# EAGLE design SMT Nixie Board (HV5622) (EAGLE 9.6.2)
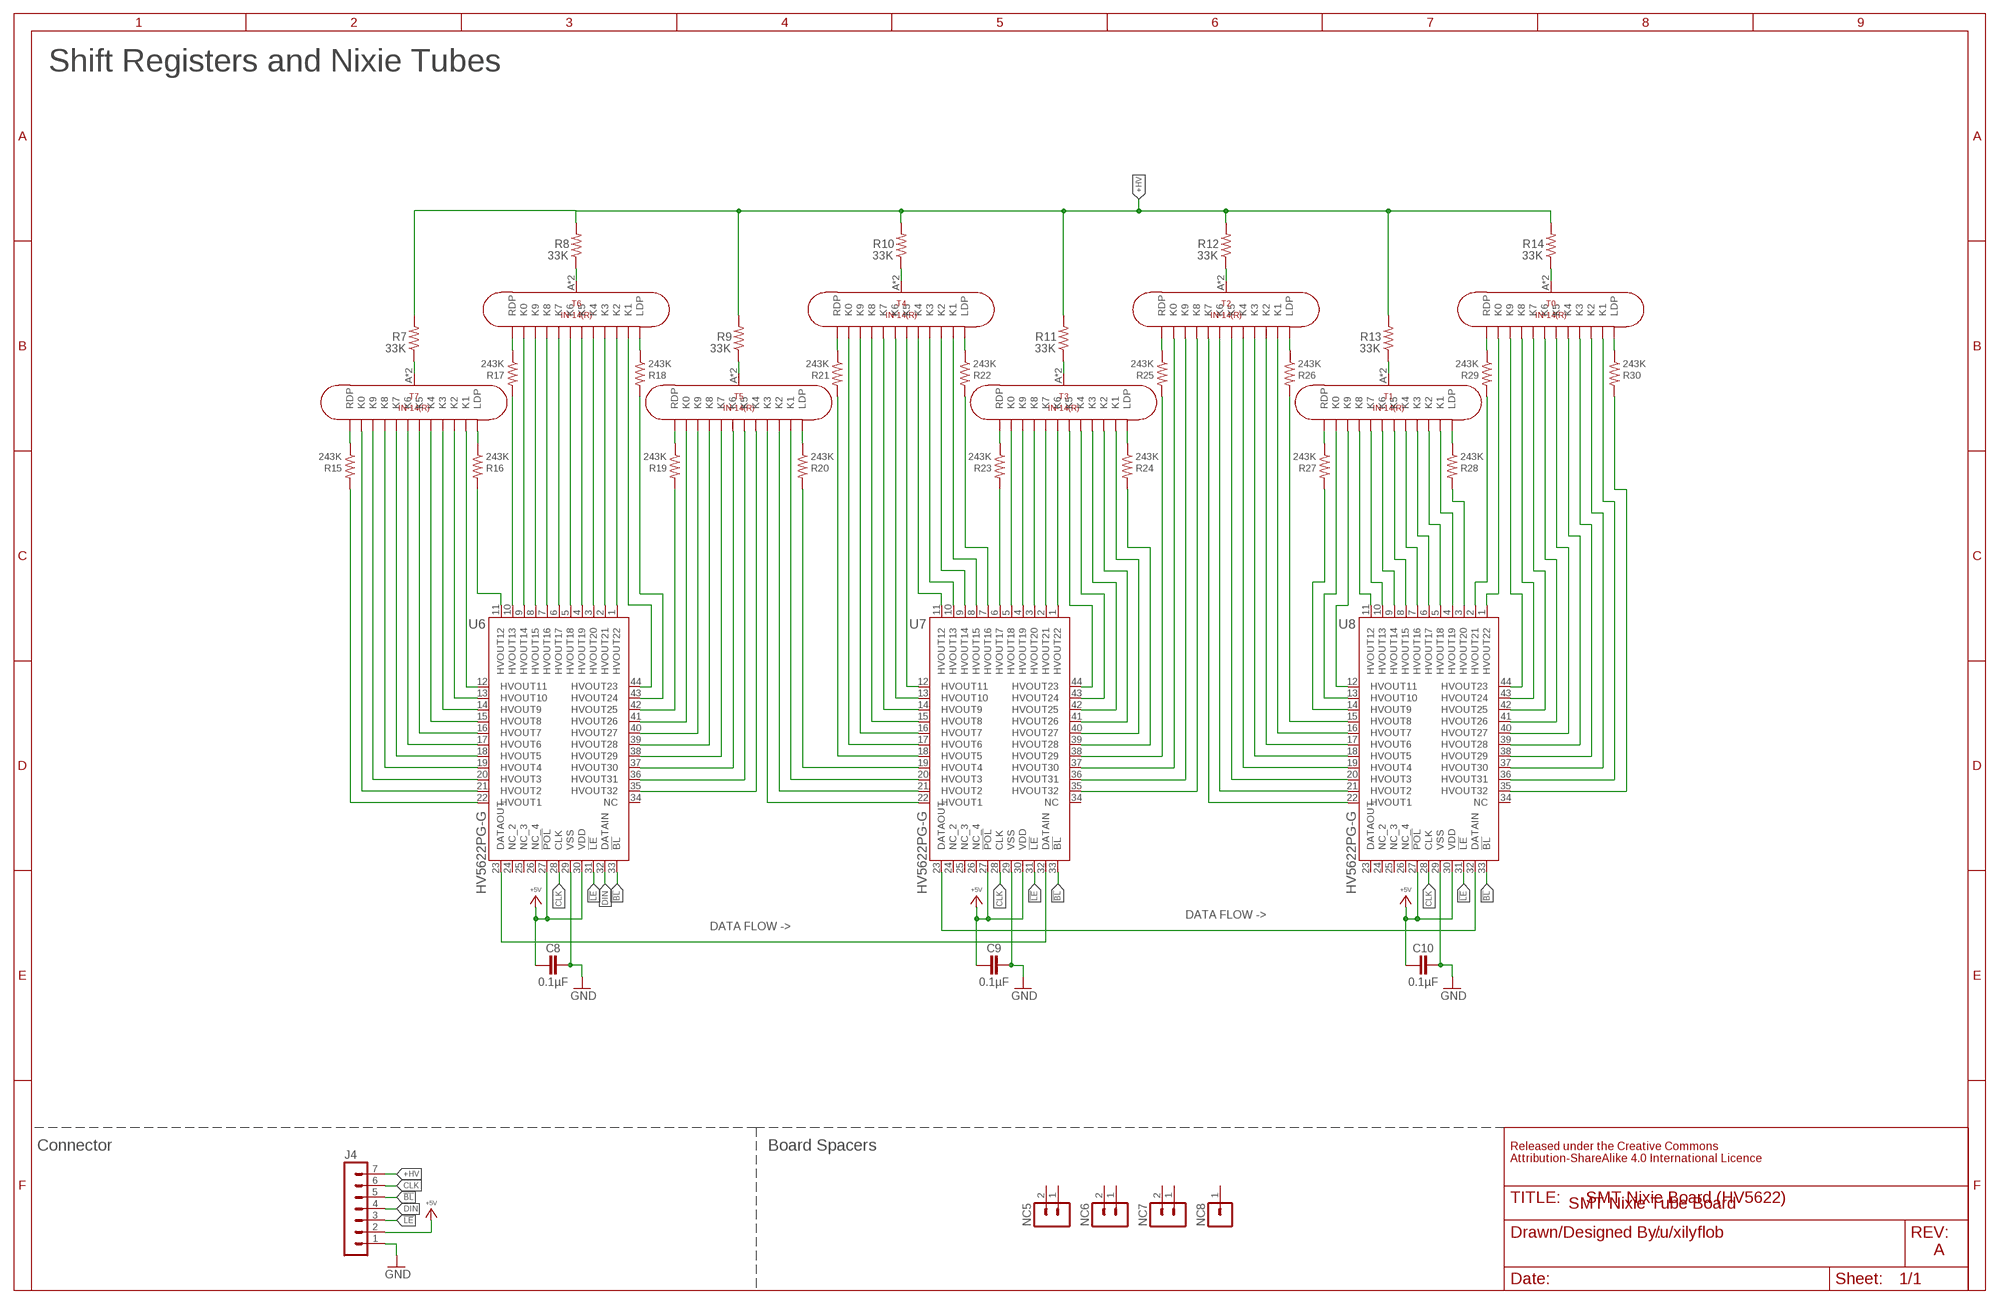
[diagram p0: schematic, sheet 1]

## Parts
C8  0.1µF  C-EU  [C0805]
C9  0.1µF  C-EU  [C0805]
C10  0.1µF  C-EU  [C0805]
J4  1  MA07  [MA07]
NC5  MA02  [MA02]
NC6  MA02  [MA02]
NC7  MA02  [MA02]
NC8  MA01  [MA01]
R7  33K  R-US_R2512  [R2512]
R8  33K  R-US_R2512  [R2512]
R9  33K  R-US_R2512  [R2512]
R10  33K  R-US_R2512  [R2512]
R11  33K  R-US_R2512  [R2512]
R12  33K  R-US_R2512  [R2512]
R13  33K  R-US_R2512  [R2512]
R14  33K  R-US_R2512  [R2512]
R15  243K  R-US_R2010  [R2010]
R16  243K  R-US_R2010  [R2010]
R17  243K  R-US_R2010  [R2010]
R18  243K  R-US_R2010  [R2010]
R19  243K  R-US_R2010  [R2010]
R20  243K  R-US_R2010  [R2010]
R21  243K  R-US_R2010  [R2010]
R22  243K  R-US_R2010  [R2010]
R23  243K  R-US_R2010  [R2010]
R24  243K  R-US_R2010  [R2010]
R25  243K  R-US_R2010  [R2010]
R26  243K  R-US_R2010  [R2010]
R27  243K  R-US_R2010  [R2010]
R28  243K  R-US_R2010  [R2010]
R29  243K  R-US_R2010  [R2010]
R30  243K  R-US_R2010  [R2010]
T0  IN-14(R)  [IN-14_REVERSE]
T1  IN-14(R)  [IN-14_REVERSE]
T2  IN-14(R)  [IN-14_REVERSE]
T3  IN-14(R)  [IN-14_REVERSE]
T4  IN-14(R)  [IN-14_REVERSE]
T5  IN-14(R)  [IN-14_REVERSE]
T6  IN-14(R)  [IN-14_REVERSE]
T7  IN-14(R)  [IN-14_REVERSE]
U6  HV5622PG-G  [QFP-44]
U7  HV5622PG-G  [QFP-44]
U8  HV5622PG-G  [QFP-44]

## Nets
!BL!: J4.5 U6.33(!BL) U7.33(!BL) U8.33(!BL)
!LE!: J4.3 U6.31(!LE) U7.31(!LE) U8.31(!LE)
+5V: C8.1 C9.1 C10.1 J4.2 U6.27(!POL) U6.30(VDD) U7.27(!POL) U7.30(VDD) U8.27(!POL) U8.30(VDD)
+HV: J4.7 R7.2 R8.2 R9.2 R10.2 R11.2 R12.2 R13.2 R14.2
CLK: J4.6 U6.28(CLK) U7.28(CLK) U8.28(CLK)
DIN: J4.4 U6.32(DATAIN)
GND: C8.2 C9.2 C10.2 J4.1 U6.29(VSS) U7.29(VSS) U8.29(VSS)
T0A: R7.1 T7.A T7.A_1(A)
T1A: R8.1 T6.A T6.A_1(A)
T2A: R9.1 T5.A T5.A_1(A)
T3A: R10.1 T4.A T4.A_1(A)
T4A: R11.1 T3.A T3.A_1(A)
T5A: R12.1 T2.A T2.A_1(A)
T6A: R13.1 T1.A T1.A_1(A)
T7A: R14.1 T0.A T0.A_1(A)
U5-T0K0: T7.K0 T7.K0_1(K0) U6.21(HVOUT2)
U5-T0K1: T7.K1 T7.K1_1(K1) U6.12(HVOUT11)
U5-T0K2: T7.K2 T7.K2_1(K2) U6.13(HVOUT10)
U5-T0K3: T7.K3 T7.K3_1(K3) U6.14(HVOUT9)
U5-T0K4: T7.K4 T7.K4_1(K4) U6.15(HVOUT8)
U5-T0K5: T7.K5 T7.K5_1(K5) U6.16(HVOUT7)
U5-T0K6: T7.K6 T7.K6_1(K6) U6.17(HVOUT6)
U5-T0K7: T7.K7 T7.K7_1(K7) U6.18(HVOUT5)
U5-T0K8: T7.K8 T7.K8_1(K8) U6.19(HVOUT4)
U5-T0K9: T7.K9 T7.K9_1(K9) U6.20(HVOUT3)
U5-T0LDP: R16.2 U6.11(HVOUT12)
U5-T0LDP1: R16.1 T7.LDP T7.LDP_1(LDP)
U5-T0RDP: R15.2 U6.22(HVOUT1)
U5-T0RDP1: R15.1 T7.RDP T7.RDP_1(RDP)
U5-T1K0: T6.K0 T6.K0_1(K0) U6.9(HVOUT14)
U5-T1K1: T6.K1 T6.K1_1(K1) U6.44(HVOUT23)
U5-T1K2: T6.K2 T6.K2_1(K2) U6.1(HVOUT22)
U5-T1K3: T6.K3 T6.K3_1(K3) U6.2(HVOUT21)
U5-T1K4: T6.K4 T6.K4_1(K4) U6.3(HVOUT20)
U5-T1K5: T6.K5 T6.K5_1(K5) U6.4(HVOUT19)
U5-T1K6: T6.K6 T6.K6_1(K6) U6.5(HVOUT18)
U5-T1K7: T6.K7 T6.K7_1(K7) U6.6(HVOUT17)
U5-T1K8: T6.K8 T6.K8_1(K8) U6.7(HVOUT16)
U5-T1K9: T6.K9 T6.K9_1(K9) U6.8(HVOUT15)
U5-T1LDP: R18.2 U6.43(HVOUT24)
U5-T1LDP1: R18.1 T6.LDP T6.LDP_1(LDP)
U5-T1RDP: R17.2 U6.10(HVOUT13)
U5-T1RDP1: R17.1 T6.RDP T6.RDP_1(RDP)
U5-T2K0: T5.K0 T5.K0_1(K0) U6.41(HVOUT26)
U5-T2K4: T5.K4 T5.K4_1(K4) U6.35(HVOUT32)
U5-T2K5: T5.K5 T5.K5_1(K5) U6.36(HVOUT31)
U5-T2K6: T5.K6 T5.K6_1(K6) U6.37(HVOUT30)
U5-T2K7: T5.K7 T5.K7_1(K7) U6.38(HVOUT29)
U5-T2K8: T5.K8 T5.K8_1(K8) U6.39(HVOUT28)
U5-T2K9: T5.K9 T5.K9_1(K9) U6.40(HVOUT27)
U5-T2RDP: R19.2 U6.42(HVOUT25)
U5-T2RDP1: R19.1 T5.RDP T5.RDP_1(RDP)
U5-U6: U6.23(DATAOUT) U7.32(DATAIN)
U6-T2K1: T5.K1 T5.K1_1(K1) U7.20(HVOUT3)
U6-T2K2: T5.K2 T5.K2_1(K2) U7.21(HVOUT2)
U6-T2K3: T5.K3 T5.K3_1(K3) U7.22(HVOUT1)
U6-T2LDP: R20.2 U7.19(HVOUT4)
U6-T2LDP1: R20.1 T5.LDP T5.LDP_1(LDP)
U6-T3K0: T4.K0 T4.K0_1(K0) U7.17(HVOUT6)
U6-T3K1: T4.K1 T4.K1_1(K1) U7.8(HVOUT15)
U6-T3K2: T4.K2 T4.K2_1(K2) U7.9(HVOUT14)
U6-T3K3: T4.K3 T4.K3_1(K3) U7.10(HVOUT13)
U6-T3K4: T4.K4 T4.K4_1(K4) U7.11(HVOUT12)
U6-T3K5: T4.K5 T4.K5_1(K5) U7.12(HVOUT11)
U6-T3K6: T4.K6 T4.K6_1(K6) U7.13(HVOUT10)
U6-T3K7: T4.K7 T4.K7_1(K7) U7.14(HVOUT9)
U6-T3K8: T4.K8 T4.K8_1(K8) U7.15(HVOUT8)
U6-T3K9: T4.K9 T4.K9_1(K9) U7.16(HVOUT7)
U6-T3LDP: R22.2 U7.7(HVOUT16)
U6-T3LDP1: R22.1 T4.LDP T4.LDP_1(LDP)
U6-T3RDP: R21.2 U7.18(HVOUT5)
U6-T3RDP1: R21.1 T4.RDP T4.RDP_1(RDP)
U6-T4K0: T3.K0 T3.K0_1(K0) U7.5(HVOUT18)
U6-T4K1: T3.K1 T3.K1_1(K1) U7.40(HVOUT27)
U6-T4K2: T3.K2 T3.K2_1(K2) U7.41(HVOUT26)
U6-T4K3: T3.K3 T3.K3_1(K3) U7.42(HVOUT25)
U6-T4K4: T3.K4 T3.K4_1(K4) U7.43(HVOUT24)
U6-T4K5: T3.K5 T3.K5_1(K5) U7.44(HVOUT23)
U6-T4K6: T3.K6 T3.K6_1(K6) U7.1(HVOUT22)
U6-T4K7: T3.K7 T3.K7_1(K7) U7.2(HVOUT21)
U6-T4K8: T3.K8 T3.K8_1(K8) U7.3(HVOUT20)
U6-T4K9: T3.K9 T3.K9_1(K9) U7.4(HVOUT19)
U6-T4LDP: R24.2 U7.39(HVOUT28)
U6-T4LDP1: R24.1 T3.LDP T3.LDP_1(LDP)
U6-T4RDP: R23.2 U7.6(HVOUT17)
U6-T4RDP1: R23.1 T3.RDP T3.RDP_1(RDP)
U6-T5K0: T2.K0 T2.K0_1(K0) U7.37(HVOUT30)
U6-T5K8: T2.K8 T2.K8_1(K8) U7.35(HVOUT32)
U6-T5K9: T2.K9 T2.K9_1(K9) U7.36(HVOUT31)
U6-T5RDP: R25.2 U7.38(HVOUT29)
U6-T5RDP1: R25.1 T2.RDP T2.RDP_1(RDP)
U6-U7: U7.23(DATAOUT) U8.32(DATAIN)
U7-T5K1: T2.K1 T2.K1_1(K1) U8.16(HVOUT7)
U7-T5K2: T2.K2 T2.K2_1(K2) U8.17(HVOUT6)
U7-T5K3: T2.K3 T2.K3_1(K3) U8.18(HVOUT5)
U7-T5K4: T2.K4 T2.K4_1(K4) U8.19(HVOUT4)
U7-T5K5: T2.K5 T2.K5_1(K5) U8.20(HVOUT3)
U7-T5K6: T2.K6 T2.K6_1(K6) U8.21(HVOUT2)
U7-T5K7: T2.K7 T2.K7_1(K7) U8.22(HVOUT1)
U7-T5LDP: R26.2 U8.15(HVOUT8)
U7-T5LDP1: R26.1 T2.LDP T2.LDP_1(LDP)
U7-T6K0: T1.K0 T1.K0_1(K0) U8.13(HVOUT10)
U7-T6K1: T1.K1 T1.K1_1(K1) U8.4(HVOUT19)
U7-T6K2: T1.K2 T1.K2_1(K2) U8.5(HVOUT18)
U7-T6K3: T1.K3 T1.K3_1(K3) U8.6(HVOUT17)
U7-T6K4: T1.K4 T1.K4_1(K4) U8.7(HVOUT16)
U7-T6K5: T1.K5 T1.K5_1(K5) U8.8(HVOUT15)
U7-T6K6: T1.K6 T1.K6_1(K6) U8.9(HVOUT14)
U7-T6K7: T1.K7 T1.K7_1(K7) U8.10(HVOUT13)
U7-T6K8: T1.K8 T1.K8_1(K8) U8.11(HVOUT12)
U7-T6K9: T1.K9 T1.K9_1(K9) U8.12(HVOUT11)
U7-T6LDP: R28.2 U8.3(HVOUT20)
U7-T6LDP1: R28.1 T1.LDP T1.LDP_1(LDP)
U7-T6RDP: R27.2 U8.14(HVOUT9)
U7-T6RDP1: R27.1 T1.RDP T1.RDP_1(RDP)
U7-T7K0: T0.K0 T0.K0_1(K0) U8.1(HVOUT22)
U7-T7K1: T0.K1 T0.K1_1(K1) U8.36(HVOUT31)
U7-T7K2: T0.K2 T0.K2_1(K2) U8.37(HVOUT30)
U7-T7K3: T0.K3 T0.K3_1(K3) U8.38(HVOUT29)
U7-T7K4: T0.K4 T0.K4_1(K4) U8.39(HVOUT28)
U7-T7K5: T0.K5 T0.K5_1(K5) U8.40(HVOUT27)
U7-T7K6: T0.K6 T0.K6_1(K6) U8.41(HVOUT26)
U7-T7K7: T0.K7 T0.K7_1(K7) U8.42(HVOUT25)
U7-T7K8: T0.K8 T0.K8_1(K8) U8.43(HVOUT24)
U7-T7K9: T0.K9 T0.K9_1(K9) U8.44(HVOUT23)
U7-T7LDP: R30.2 U8.35(HVOUT32)
U7-T7LDP1: R30.1 T0.LDP T0.LDP_1(LDP)
U7-T7RDP: R29.2 U8.2(HVOUT21)
U7-T7RDP1: R29.1 T0.RDP T0.RDP_1(RDP)
Unconnected: NC5.1 NC5.2 NC6.1 NC6.2 NC7.1 NC7.2 NC8.1 U6.24(NC_2) U6.25(NC_3) U6.26(NC_4) U6.34(NC) U7.24(NC_2) U7.25(NC_3) U7.26(NC_4) U7.34(NC) U8.23(DATAOUT) U8.24(NC_2) U8.25(NC_3) U8.26(NC_4) U8.34(NC)

## Notes on the sheet
- Shift Registers and Nixie Tubes
- DATA FLOW ->
- DATA FLOW ->
- Connector | Board Spacers
- Released under the Creative Commons
  Attribution-ShareAlike 4.0 International Licence
- SMT Nixie Tube Board
- /u/xilyflob
- A

## Library data of the parts
C8-C10 = My Imported Components:C-EU
J4 = My Imported Components:MA07: PIN HEADER; OC_FARNELL: unknown; OC_NEWARK: unknown
NC5-NC7 = My Imported Components:MA02: PIN HEADER
NC8 = My Imported Components:MA01: PIN HEADER
R7-R30 = rcl:R-US_: RESISTOR, American symbol; SPICEPREFIX: R
T0 T1-T7 = My Imported Components:IN-14
U6-U8 = My Imported Components:HV5622PG-G; BUILT_BY: EMA_Jessica; COPYRIGHT: Copyright (C) 2018 Accelerated Designs. All rights reserved; MANUFACTURER_PART_NUMBER: HV5622PG-G; SOURCELIBRARY: Microchip_2019-08-23_19; VENDOR: Microchip

## Board
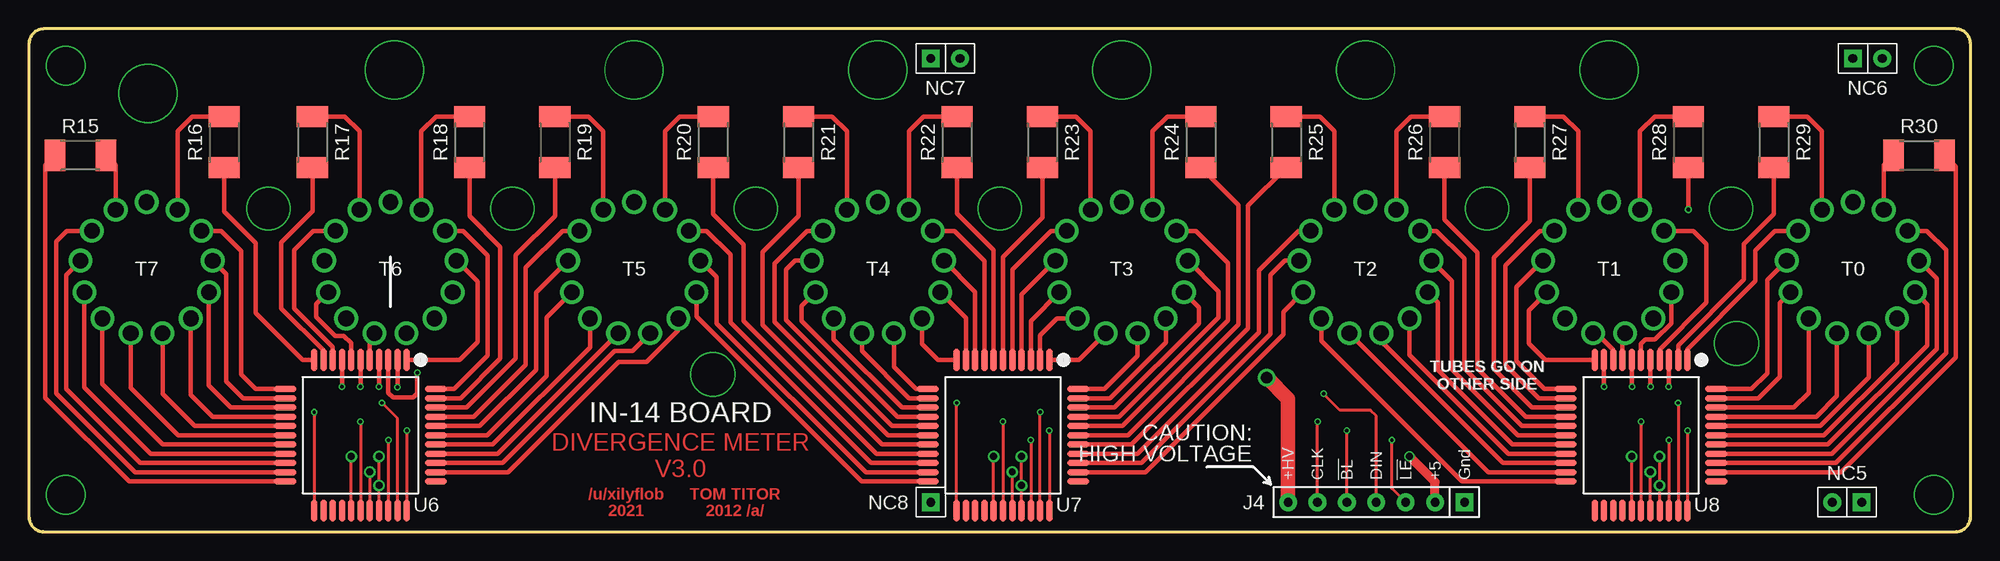
[diagram p1: board, top side]
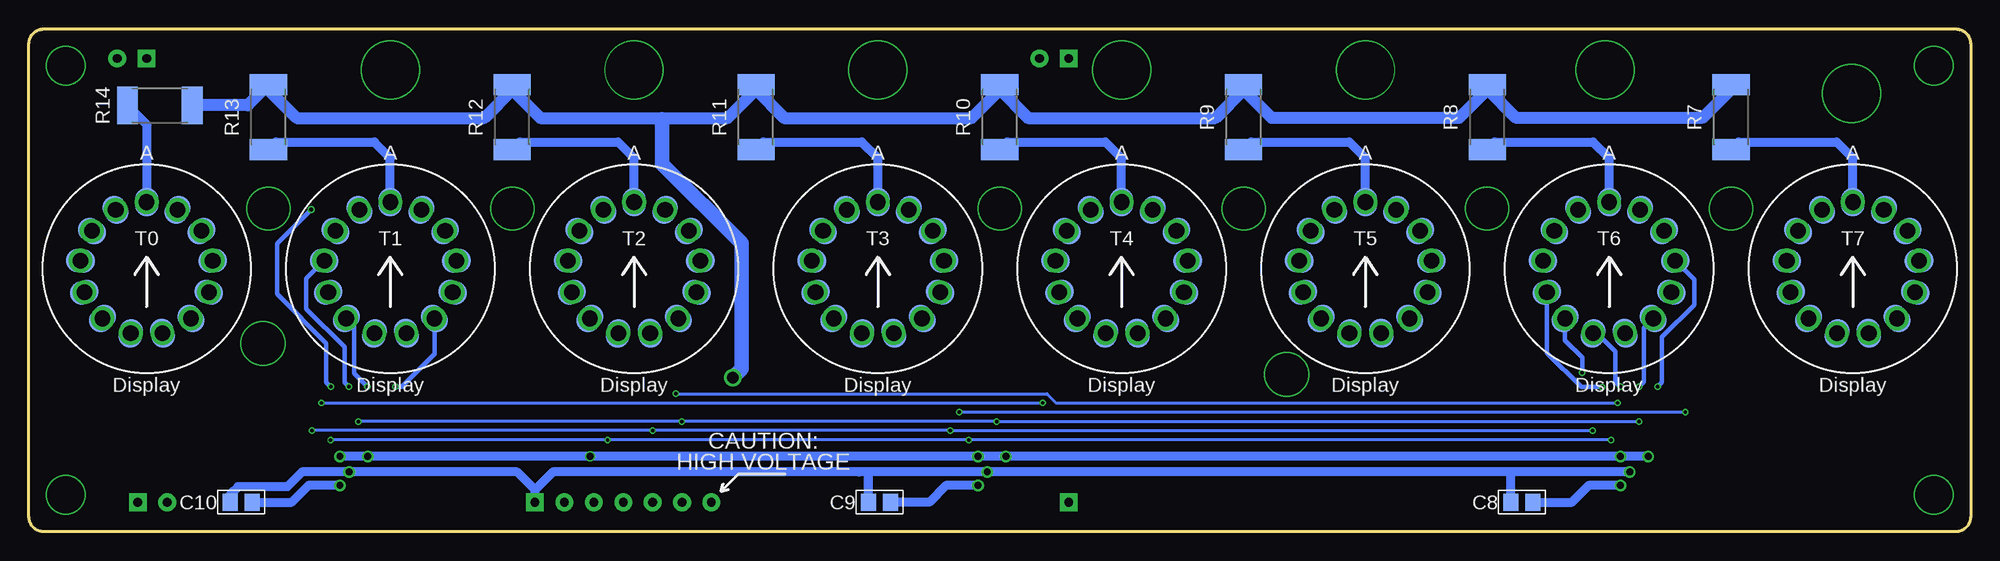
[diagram p2: board, bottom side, seen from below]

Size 167.64 x 43.43 mm. Coordinates in mm from the lower left corner, seen from the top.
Outline: 167.64,1.27 167.64,42.16 arc90 166.37,43.43 1.27,43.43 arc90 0,42.16 0,1.27 arc90 1.27,0 166.37,0 arc90 167.64,1.27
Copper layers (1*16): Top 0.035559375mm / dielectric 1.6mm / Bottom 0.035559375mm
Design rules "oshpark-2layer *": minimum track width 6mil, minimum drill 10mil, track to track 6mil, track to pad 6mil, pad to pad 6mil, via to via 6mil, smd to smd 6mil, copper to edge 15mil, drill to drill 6mil, minimum pad ring 5mil, minimum via ring 5mil, stop-mask expansion 2.5mil, vias tented up to drill 30mil, thermal gap 10mil

### Footprints (pad centres in the part's own frame; a part is rotated, then mirrored left to right if it is on the bottom)
C0805 = smd 1.3 x 1.5: 1 -0.95,0; 2 0.95,0
MA07 = drill 0.75 pad 1.524 square: 1 -7.62,0 | drill 0.75 pad 1.524: 2 -5.08,0; 3 -2.54,0; 4 0,0; 5 2.54,0; 6 5.08,0; 7 7.62,0
MA02 = drill 0.75 pad 1.524 square: 1 -1.27,0 | drill 0.75 pad 1.524: 2 1.27,0
MA01 = drill 0.75 pad 1.524 square: 1 0,0
R2512 = smd 1.8 x 3.2: 1 -2.8,0; 2 2.8,0
R2010 = smd 1.8 x 2.7: 1 -2.2,0; 2 2.2,0
IN-14_REVERSE = drill 1.35 pad 2.05: A 0,5.75; K0 4.732,3.266; K1 -4.732,3.266; K2 -5.708,0.693; K3 -5.376,-2.039; K4 -3.813,-4.304; K5 -1.376,-5.583; K6 1.376,-5.583; K7 3.813,-4.304; K8 5.376,-2.039; K9 5.708,0.693; LDP -2.672,5.091; RDP 2.672,5.091 | smd 2.05 x 2.5: A_1 0,5.75 | smd 2.05 x 2.5 rotated 124.6: K0_1 4.732,3.266 | smd 2.05 x 2.5 rotated 235.4: K1_1 -4.732,3.266 | smd 2.05 x 2.5 rotated 263.1: K2_1 -5.708,0.693 | smd 2.05 x 2.5 rotated 290.7: K3_1 -5.376,-2.039 | smd 2.05 x 2.5 rotated 318.4: K4_1 -3.813,-4.304 | smd 2.05 x 2.5 rotated 346.1: K5_1 -1.376,-5.583 | smd 2.05 x 2.5 rotated 13.9: K6_1 1.376,-5.583 | smd 2.05 x 2.5 rotated 41.6: K7_1 3.813,-4.304 | smd 2.05 x 2.5 rotated 69.3: K8_1 5.376,-2.039 | smd 2.05 x 2.5 rotated 96.9: K9_1 5.708,0.693 | smd 2.05 x 2.5 rotated 207.7: LDP_1 -2.672,5.091 | smd 2.05 x 2.5 rotated 152.3: RDP_1 2.672,5.091
QFP-44 = smd 1.9 x 0.55: 1 -6.5,4; 2 -6.5,3.2; 3 -6.5,2.4; 4 -6.5,1.6; 5 -6.5,0.8; 6 -6.5,0; 7 -6.5,-0.8; 8 -6.5,-1.6; 9 -6.5,-2.4; 10 -6.5,-3.2; 11 -6.5,-4; 23 6.5,-4; 24 6.5,-3.2; 25 6.5,-2.4; 26 6.5,-1.6; 27 6.5,-0.8; 28 6.5,0; 29 6.5,0.8; 30 6.5,1.6; 31 6.5,2.4; 32 6.5,3.2; 33 6.5,4 | smd 0.55 x 1.9: 12 -4,-6.5; 13 -3.2,-6.5; 14 -2.4,-6.5; 15 -1.6,-6.5; 16 -0.8,-6.5; 17 0,-6.5; 18 0.8,-6.5; 19 1.6,-6.5; 20 2.4,-6.5; 21 3.2,-6.5; 22 4,-6.5; 34 4,6.5; 35 3.2,6.5; 36 2.4,6.5; 37 1.6,6.5; 38 0.8,6.5; 39 0,6.5; 40 -0.8,6.5; 41 -1.6,6.5; 42 -2.4,6.5; 43 -3.2,6.5; 44 -4,6.5

### Placement (x,y rotation side)
C8  38.73,2.54 180 bottom
C9  94.21,2.54 180 bottom
C10  149.3,2.54 180 bottom
J4  116.33,2.54 180 top
NC5  156.97,2.54 180 top
NC6  158.75,40.89 0 top
NC7  79.12,40.89 0 top
NC8  77.85,2.54 180 top
R7  20.68,35.81 90 bottom
R8  41.73,35.81 90 bottom
R9  62.76,35.81 90 bottom
R10  83.82,35.81 90 bottom
R11  104.88,35.81 90 bottom
R12  125.91,35.81 90 bottom
R13  146.96,35.81 90 bottom
R14  156.34,36.83 0 bottom
R15  4.45,32.51 180 top
R16  16.87,33.66 270 top
R17  24.49,33.66 270 top
R18  38.05,33.66 270 top
R19  45.42,33.66 270 top
R20  59.08,33.66 270 top
R21  66.45,33.66 270 top
R22  80.14,33.66 270 top
R23  87.5,33.66 270 top
R24  101.19,33.66 270 top
R25  108.56,33.66 270 top
R26  122.22,33.66 270 top
R27  129.59,33.66 270 top
R28  143.28,33.66 270 top
R29  150.65,33.66 270 top
R30  163.19,32.51 0 top
T0  157.48,22.73 0 bottom
T1  136.43,22.73 0 bottom
T2  115.39,22.73 0 bottom
T3  94.34,22.73 0 bottom
T4  73.3,22.73 0 bottom
T5  52.25,22.73 0 bottom
T6  31.21,22.73 0 bottom
T7  10.16,22.73 0 bottom
U6  28.63,8.33 270 top
U7  84.1,8.33 270 top
U8  139.19,8.33 270 top

### Tracks (layer width: path | path; a pad name or v marks a point on that pad's centre or on a via)
!BL!  (via drill 0.3 pad 0.55)
  Top 0.254: J4.5 v113.79,8.74 | v88.1,8.74 U7.33 | v32.63,8.74 U6.33 | v143.19,8.74 U8.33
  Bottom 0.254: v32.63,8.74 v88.1,8.74 v113.79,8.74 v143.19,8.74
!LE!  (via drill 0.3 pad 0.55)
  Top 0.254: J4.3 117.68,3.73 v117.68,7.92 | v86.5,7.92 U7.31 | v31.03,7.92 U6.31 | v141.59,7.92 U8.31
  Bottom 0.254: v31.03,7.92 v86.5,7.92 v117.68,7.92 v141.59,7.92
+5V  (via drill 0.6 pad 0.8, 0.6 pad 1)
  Top 0.254: U6.27 v27.83,6.5 | U6.30 v30.23,3.99 v30.23,6.5 | U7.30 v85.7,3.99 v85.7,6.5 | U7.27 v83.3,6.5 | U8.30 v140.79,3.99 v140.79,6.5 | U8.27 v138.39,6.5
  Top 0.762: J4.2 121.41,4.29 v119.2,6.5
  Bottom 0.762: v27.83,6.5 v30.23,6.5 v83.3,6.5 v85.7,6.5 v119.2,6.5 v138.39,6.5 v140.79,6.5 | v140.79,3.99 143.51,3.99 144.96,2.54 C10.1 | v85.7,3.99 88.44,3.99 89.89,2.54 C9.1 | v30.23,3.99 32.97,3.99 34.42,2.54 C8.1
+HV  (via drill 1 pad 1.5)
  Top 1.27: v106.88,13.31 108.71,11.48 J4.7
  Bottom 0.762: 112.98,35.23 112.98,35.74
  Bottom 1.016: 62.77,38.18 65.21,35.74 81.38,35.74 83.82,38.18 | 83.82,38.18 86.26,35.74 102.43,35.74 104.88,38.19 R11.2 104.88,38.16 107.3,35.74 112.98,35.74 123.47,35.74 125.91,38.17 R12.2 125.91,38.18 128.35,35.74 144.52,35.74 146.96,38.18 R13.2 148.75,36.83 R14.2 | R8.2 41.73,38.23 | 41.73,38.23 41.73,38.18 44.17,35.74 60.33,35.74 62.77,38.18 | 41.73,38.23 39.29,35.79 23.11,35.79 20.68,38.23 R7.2 | R10.2 83.82,38.18 | R9.2 62.77,38.18
  Bottom 1.27: v106.88,13.31 106.12,14.07 106.12,24.92 112.98,31.77 112.98,35.23
CLK  (via drill 0.3 pad 0.55)
  Top 0.254: J4.6 v111.25,9.53 | v84.1,9.53 U7.28 | v28.63,9.53 U6.28 | v139.19,9.53 U8.28
  Bottom 0.254: v28.63,9.53 v84.1,9.53 v111.25,9.53 v139.19,9.53
DIN  (via drill 0.3 pad 0.55)
  Top 0.254: v30.48,11.12 31.83,9.78 U6.32 | v111.78,11.91 113.21,10.49 115.82,10.49 116.33,9.98 J4.4
  Bottom 0.254: v111.78,11.91 79.73,11.91 78.94,11.12 v30.48,11.12
GND  (via drill 0.6 pad 1)
  Top 0.254: v29.43,5.16 U6.29 | U7.29 v84.9,5.16 | U8.29 v139.99,5.16
  Bottom 0.762: v29.43,5.16 39.7,5.16 | 39.7,5.16 v84.9,5.16 95.15,5.16 | 95.15,5.16 96.01,5.16 122.4,5.16 123.95,3.61 | J4.1 123.95,3.61 | 123.95,3.61 125.5,5.16 v139.99,5.16 144.07,5.16 145.34,3.89 149.58,3.89 150.25,3.22 C10.2 | C8.2 39.69,5.14 39.7,5.16 | C9.2 95.16,5.15 95.15,5.16
N$1  (via drill 3.66)
  other vias: 59.05,13.59
N$2  (via drill 4.88)
  other vias: 52.25,39.88
N$3  (via drill 3.58)
  other vias: 83.82,27.91
N$4  (via drill 3.58)
  other vias: 62.76,27.91
N$5  (via drill 3.58)
  other vias: 20.68,27.91
N$6  (via drill 3.66)
  other vias: 147.45,16.26
N$7  (via drill 4.88)
  other vias: 115.39,39.88
N$8  (via drill 3.58)
  other vias: 41.73,27.91
N$9  (via drill 3.58)
  other vias: 146.96,27.91
N$10  (via drill 3.17)
  other vias: 3.17,3.17
N$11  (via drill 3.17)
  other vias: 164.47,3.17
N$12  (via drill 3.17)
  other vias: 3.17,40.26
N$13  (via drill 3.17)
  other vias: 164.47,40.26
N$14  (via drill 4.88)
  other vias: 73.29,39.88
N$15  (via drill 4.88)
  other vias: 94.35,39.88
N$16  (via drill 4.88)
  other vias: 136.44,39.88
N$17  (via drill 4.88)
  other vias: 31.55,39.88
N$18  (via drill 3.58)
  other vias: 125.91,27.91
N$19  (via drill 4.88)
  other vias: 10.29,37.85
T0A
  Bottom 0.762: T7.A_1 10.16,32.26 11.56,33.66 20.04,33.66 R7.1
T1A
  Bottom 0.762: T6.A_1 31.21,32.26 32.6,33.66 41.09,33.66 R8.1
T2A
  Bottom 0.762: T5.A_1 52.25,32.26 53.65,33.66 62.12,33.66 R9.1
T3A
  Bottom 0.762: T4.A_1 73.3,32.26 74.69,33.66 83.18,33.66 R10.1
T4A
  Bottom 0.762: T3.A_1 94.34,32.26 95.74,33.66 104.24,33.66 R11.1
T5A
  Bottom 0.762: T2.A_1 115.39,32.26 116.79,33.66 125.27,33.66 R12.1
T6A
  Bottom 0.762: T1.A_1 136.43,32.26 137.83,33.66 146.32,33.66 R13.1
T7A
  Bottom 0.762: R14.1 157.48,35.17 T0.A_1
U5-T0K0
  Top 0.381: U6.21 9.17,5.13 2.34,11.96 2.34,25.08 3.25,25.99 T7.K0_1
U5-T0K1
  Top 0.381: U6.12 19.58,12.33 18.31,13.6 18.31,24.26 16.58,25.99 T7.K1_1
U5-T0K2
  Top 0.381: U6.13 18.48,11.53 17.04,12.97 17.04,22.24 T7.K2_1 | T7.K2_1
U5-T0K3
  Top 0.381: U6.14 17.43,10.73 15.54,12.62 T7.K3_1
U5-T0K4
  Top 0.381: U6.15 15.88,9.93 13.97,11.84 T7.K4_1
U5-T0K5
  Top 0.381: U6.16 14.29,9.13 11.54,11.89 T7.K5_1
U5-T0K6
  Top 0.381: U6.17 12.87,8.33 8.78,12.42 T7.K6_1
U5-T0K7
  Top 0.381: U6.18 11.57,7.53 6.35,12.75 T7.K7_1
U5-T0K8
  Top 0.381: U6.19 10.5,6.73 4.78,12.45 T7.K8_1
U5-T0K9
  Top 0.381: U6.20 9.61,5.93 3.23,12.32 3.23,22.19 T7.K9_1
U5-T0LDP
  Top 0.381: U6.11 23.65,14.83 19.58,18.9 19.58,24.94 16.87,27.66 R16.2
U5-T0LDP1
  Top 0.381: T7.LDP_1 12.83,34.59 14.1,35.85 R16.1
U5-T0RDP
  Top 0.381: U6.22 8.65,4.33 1.42,11.56 1.42,31.69 R15.2
U5-T0RDP1
  Top 0.381: T7.RDP_1 7.49,31.67 R15.1
U5-T1K0
  Top 0.381: U6.9 26.23,15.95 22.9,19.28 22.9,24.33 24.56,25.99 T6.K0_1
U5-T1K1
  Top 0.381: U6.44 36.73,12.33 39.61,15.21 39.61,23.85 37.47,25.99 T6.K1_1
U5-T1K2
  Top 0.381: U6.1 37.17,14.83 38.72,16.38 38.72,21.61 T6.K2_1 | T6.K2_1
U5-T1K3  (via drill 0.3 pad 0.55)
  Top 0.381: U6.2 v31.83,12.5
  Bottom 0.381: v31.83,12.5 33.62,12.5 36.58,15.46 | T6.K3_1 36.58,15.46 | 36.58,15.46
U5-T1K4  (via drill 0.3 pad 0.55)
  Top 0.381: U6.3 31.03,12 31.45,11.58 33.17,11.58 33.53,11.94 v33.53,13.74
  Bottom 0.381: v33.53,13.74 33.53,15.04 35.02,16.53 T6.K4_1
U5-T1K5  (via drill 0.3 pad 0.55)
  Top 0.381: U6.4 v30.23,12.52
  Bottom 0.381: v30.23,12.52 30.65,12.94 30.65,15.56 32.23,17.14 T6.K5_1
U5-T1K6
  Top 0.381: U6.5 29.43,16.74 T6.K6_1
U5-T1K7  (via drill 0.3 pad 0.55)
  Top 0.381: U6.6 v28.63,12.52
  Bottom 0.381: v28.63,12.52 28.21,12.94 28.21,17.61 T6.K7_1 | T6.K7_1
U5-T1K8
  Top 0.381: U6.7 27.83,16.28 27.19,16.92 26.43,16.92 24.8,18.54 24.8,19.66 T6.K8_1
U5-T1K9  (via drill 0.3 pad 0.55)
  Top 0.381: U6.8 v27.03,12.52
  Bottom 0.381: v27.03,12.52 26.63,12.91 26.63,16.82 23.86,19.58 23.86,21.79 T6.K9_1
U5-T1LDP
  Top 0.381: U6.43 37.26,11.53 40.69,14.96 40.69,24.61 38.05,27.25 R18.2
U5-T1LDP1
  Top 0.381: R18.1 35.15,35.85 33.88,34.59 T6.LDP_1
U5-T1RDP
  Top 0.381: U6.10 25.43,15.65 21.79,19.28 21.79,24.99 24.49,27.69 R17.2
U5-T1RDP1
  Top 0.381: T6.RDP_1 28.53,34.59 27.26,35.85 R17.1
U5-T2K0
  Top 0.381: U6.41 38.38,9.93 42.88,14.43 42.88,22.81 46.06,25.99 T5.K0_1
U5-T2K4
  Top 0.381: U6.35 41.38,5.13 50.91,14.66 53.32,14.66 56.06,17.4 T5.K4_1
U5-T2K5
  Top 0.381: U6.36 40.88,5.93 50.58,15.62 52.11,15.62 T5.K5_1 | T5.K5_1
U5-T2K6
  Top 0.381: U6.37 40.46,6.73 T5.K6_1
U5-T2K7
  Top 0.381: U6.38 40.05,7.53 48.44,15.92 T5.K7_1
U5-T2K8
  Top 0.381: U6.39 39.58,8.33 44.68,13.44 44.68,18.49 T5.K8_1
U5-T2K9
  Top 0.381: U6.40 38.93,9.13 43.77,13.97 43.77,20.64 T5.K9_1
U5-T2RDP
  Top 0.381: U6.42 37.78,10.73 42.04,14.99 42.04,23.88 45.41,27.26 R19.2
U5-T2RDP1
  Top 0.381: R19.1 48.31,35.85 49.58,34.59 T5.RDP_1
U5-U6  (via drill 0.3 pad 0.55)
  Top 0.254: v24.63,10.34 U6.23 | U7.32 v87.3,10.34
  Bottom 0.254: v87.3,10.34 v24.63,10.34
U6-T2K1
  Top 0.381: U7.20 72.71,5.93 60.58,18.06 60.58,23.93 58.52,25.99 T5.K1_1
U6-T2K2
  Top 0.381: U7.21 72.27,5.13 59.39,18.01 59.39,21.99 T5.K2_1
U6-T2K3
  Top 0.381: U7.22 71.87,4.33 57.63,18.58 T5.K3_1
U6-T2LDP
  Top 0.381: U7.19 73.2,6.73 61.72,18.21 61.72,24.82 59.08,27.46 R20.2
U6-T2LDP1
  Top 0.381: R20.1 56.19,35.85 54.92,34.59 T5.LDP_1
U6-T3K0
  Top 0.381: U7.17 74.16,8.33 64.36,18.14 64.36,23.16 67.18,25.99 T4.K0_1
U6-T3K1
  Top 0.381: U7.8 82.5,23.39 79.89,25.99 T4.K1_1
U6-T3K2
  Top 0.381: U7.9 81.7,20.72 T4.K2_1
U6-T3K3
  Top 0.381: U7.10 80.9,18.46 T4.K3_1
U6-T3K4
  Top 0.381: U7.11 78.51,14.83 77.11,16.23 T4.K4_1
U6-T3K5
  Top 0.381: U7.12 76.59,12.33 74.67,14.24 T4.K5_1
U6-T3K6
  Top 0.381: U7.13 75.99,11.53 71.92,15.6 T4.K6_1
U6-T3K7
  Top 0.381: U7.14 75.37,10.73 69.48,16.61 T4.K7_1
U6-T3K8
  Top 0.381: U7.15 75,9.93 66.72,18.21 66.72,19.48 T4.K8_1
U6-T3K9
  Top 0.381: U7.16 74.53,9.13 65.37,18.29 65.37,22.66 66.13,23.42 T4.K9_1
U6-T3LDP
  Top 0.381: U7.7 83.3,24.33 80.14,27.5 R22.2
U6-T3LDP1
  Top 0.381: R22.1 77.24,35.85 75.97,34.59 T4.LDP_1
U6-T3RDP
  Top 0.381: U7.18 73.65,7.53 63.32,17.86 63.32,24.14 66.45,27.27 R21.2
U6-T3RDP1
  Top 0.381: R21.1 69.36,35.85 70.62,34.59 T4.RDP_1
U6-T4K0
  Top 0.381: U7.5 84.9,22.66 88.23,25.99 T3.K0_1
U6-T4K1
  Top 0.381: U7.40 94.42,9.13 103.53,18.24 103.53,23.22 100.75,25.99 T3.K1_1
U6-T4K2
  Top 0.381: U7.41 94.11,9.93 102.7,18.52 102.7,20.77 T3.K2_1
U6-T4K3
  Top 0.381: U7.42 93.75,10.73 101.02,18.01 101.02,19.38 T3.K3_1
U6-T4K4
  Top 0.381: U7.43 93.35,11.53 98.16,16.34 T3.K4_1
U6-T4K5
  Top 0.381: U7.44 92.86,12.33 95.72,15.19 T3.K5_1
U6-T4K6
  Top 0.381: U7.1 90.66,14.83 T3.K6_1
U6-T4K7
  Top 0.381: U7.2 87.3,16.96 88.76,18.42 T3.K7_1
U6-T4K8
  Top 0.381: U7.3 86.5,18.22 T3.K8_1
U6-T4K9
  Top 0.381: U7.4 85.7,20.48 T3.K9_1
U6-T4LDP
  Top 0.381: U7.39 94.87,8.33 104.42,17.88 104.42,28.23 R24.2
U6-T4LDP1
  Top 0.381: R24.1 98.28,35.85 97.02,34.59 T3.LDP_1
U6-T4RDP
  Top 0.381: U7.6 84.1,23.75 87.5,27.15 R23.2
U6-T4RDP1
  Top 0.381: R23.1 90.4,35.85 91.67,34.59 T3.RDP_1
U6-T5K0
  Top 0.381: U7.37 95.7,6.73 106.19,17.22 106.19,22.58 109.61,25.99 T2.K0_1
U6-T5K8
  Top 0.381: U7.35 96.42,5.13 108.33,17.04 108.33,19 T2.K8_1
U6-T5K9
  Top 0.381: U7.36 96.07,5.93 107.21,17.07 107.21,22.17 108.45,23.42 T2.K9_1
U6-T5RDP
  Top 0.381: U7.38 95.21,7.53 105.26,17.58 105.26,28.15 R25.2
U6-T5RDP1
  Top 0.381: R25.1 111.45,35.85 112.72,34.59 T2.RDP_1
U6-U7  (via drill 0.3 pad 0.55)
  Top 0.254: U7.23 v80.1,11.12 | v142.39,11.12 U8.32
  Bottom 0.254: v142.39,11.12 v80.1,11.12
U7-T5K1
  Top 0.381: U8.16 128.91,9.13 123.92,14.12 123.92,23.6 121.53,25.99 T2.K1_1
U7-T5K2
  Top 0.381: U8.17 128.55,8.33 122.86,14.02 122.86,21.66 T2.K2_1
U7-T5K3
  Top 0.381: U8.18 128.1,7.53 121.64,13.99 121.64,19.82 T2.K3_1
U7-T5K4
  Top 0.381: U8.19 127.73,6.73 119.2,15.26 T2.K4_1
U7-T5K5
  Top 0.381: U8.20 127.26,5.93 116.77,16.43 T2.K5_1
U7-T5K6
  Top 0.381: U8.21 126.02,5.13 T2.K6_1
U7-T5K7
  Top 0.381: U8.22 123.71,4.33 111.58,16.46 T2.K7_1
U7-T5LDP
  Top 0.381: U8.15 129.26,9.93 125.07,14.12 125.07,24.11 122.22,26.95 R26.2
U7-T5LDP1
  Top 0.381: R26.1 119.33,35.85 118.06,34.59 T2.LDP_1
U7-T6K0
  Top 0.381: U8.13 130.36,11.53 127.47,14.43 127.47,22.99 130.47,25.99 T1.K0_1
U7-T6K1
  Top 0.381: U8.4 140.79,15.74 144.84,19.79 144.84,24.87 143.72,25.99 T1.K1_1
U7-T6K2  (via drill 0.3 pad 0.55)
  Top 0.381: U8.5 139.99,12.54 v140,12.52
  Bottom 0.381: v140,12.52 140.4,12.91 140.4,15.95 143.7,19.25 143.7,21.86 T1.K2_1
U7-T6K3
  Top 0.381: U8.6 139.19,16.23 139.55,16.59 140.39,16.59 141.81,18.01 T1.K3_1
U7-T6K4  (via drill 0.3 pad 0.55)
  Top 0.381: U8.7 138.39,12.54 v138.41,12.52
  Bottom 0.381: v138.41,12.52 139.56,13.68 139.56,17.73 T1.K4_1
U7-T6K5
  Top 0.381: U8.8 137.59,16.92 T1.K5_1
U7-T6K6
  Top 0.381: U8.9 136.79,15.72 135.37,17.14 T1.K6_1
U7-T6K7  (via drill 0.3 pad 0.55)
  Top 0.381: U8.10 v135.99,12.52
  Bottom 0.381: T1.K7_1 132.62,15.37 135.47,12.52 v135.99,12.52
U7-T6K8
  Top 0.381: U8.11 130.95,14.83 129.5,16.28 129.5,19.13 T1.K8_1
U7-T6K9
  Top 0.381: U8.12 130.86,12.33 128.43,14.76 128.43,21.12 T1.K9_1
U7-T6LDP  (via drill 0.3 pad 0.55, 0.35)
  Top 0.381: U8.3 141.59,12.54 v141.58,12.52 | v143.28,27.81 R28.2
  Bottom 0.381: v141.58,12.52 141.96,12.9 141.96,16.28 146.2,20.52 146.2,24.89 v143.28,27.81
U7-T6LDP1
  Top 0.381: R28.1 140.38,35.85 139.11,34.59 T1.LDP_1
U7-T6RDP
  Top 0.381: U8.14 129.78,10.73 126.47,14.05 126.47,23.7 129.59,26.82 R27.2
U7-T6RDP1
  Top 0.381: R27.1 132.49,35.85 133.76,34.59 T1.RDP_1
U7-T7K0
  Top 0.381: U8.1 143.19,15.76 149.07,21.64 149.07,24.31 150.76,25.99 T0.K0_1
U7-T7K1
  Top 0.381: U8.36 156.02,5.93 165.53,15.44 165.53,24.33 163.87,25.99 T0.K1_1
U7-T7K2
  Top 0.381: U8.37 155.68,6.73 164.72,15.77 164.72,21.89 T0.K2_1
U7-T7K3
  Top 0.381: U8.38 155.33,7.53 163.91,16.1 163.91,19.64 T0.K3_1
U7-T7K4
  Top 0.381: U8.39 154.99,8.33 161.29,14.63 T0.K4_1
U7-T7K5
  Top 0.381: T0.K5_1 158.86,13.34 154.65,9.13 U8.40
U7-T7K6
  Top 0.381: U8.41 154.31,9.93 156.1,11.73 T0.K6_1
U7-T7K7
  Top 0.381: U8.42 152.4,10.73 153.67,12 T0.K7_1
U7-T7K8
  Top 0.381: U8.43 149.3,11.53 151.16,13.39 151.16,19.74 T0.K8_1
U7-T7K9
  Top 0.381: U8.44 148.73,12.33 150.09,13.69 150.09,21.73 T0.K9_1
U7-T7LDP
  Top 0.381: U8.35 156.44,5.13 166.37,15.06 166.37,31.54 R30.2
U7-T7LDP1
  Top 0.381: T0.LDP_1 160.15,31.67 R30.1
U7-T7RDP
  Top 0.381: U8.2 142.39,16.1 148.06,21.77 148.06,24.87 150.65,27.46 R29.2
U7-T7RDP1
  Top 0.381: R29.1 153.54,35.85 154.81,34.59 T0.RDP_1

### Text on the board
Top: DIVERGENCE METER / V3.0 | /u/xilyflob / 2021 | TOM TITOR / 2012 /a/
tPlace: TUBES GO ON / OTHER SIDE | IN-14 BOARD | CAUTION: / HIGH VOLTAGE | +HV | CLK | !BL! | DIN | !LE! | +5 | Gnd
bPlace: CAUTION: / HIGH VOLTAGE
tStop: DIVERGENCE METER / V3.0 | /u/xilyflob / 2021 | TOM TITOR / 2012 /a/